# EAGLE design IMU_Digital_Combo_Board _-_6_Degrees_of_Freedom_-_ITG3200_-_ADXL345 (EAGLE 6.5.0)
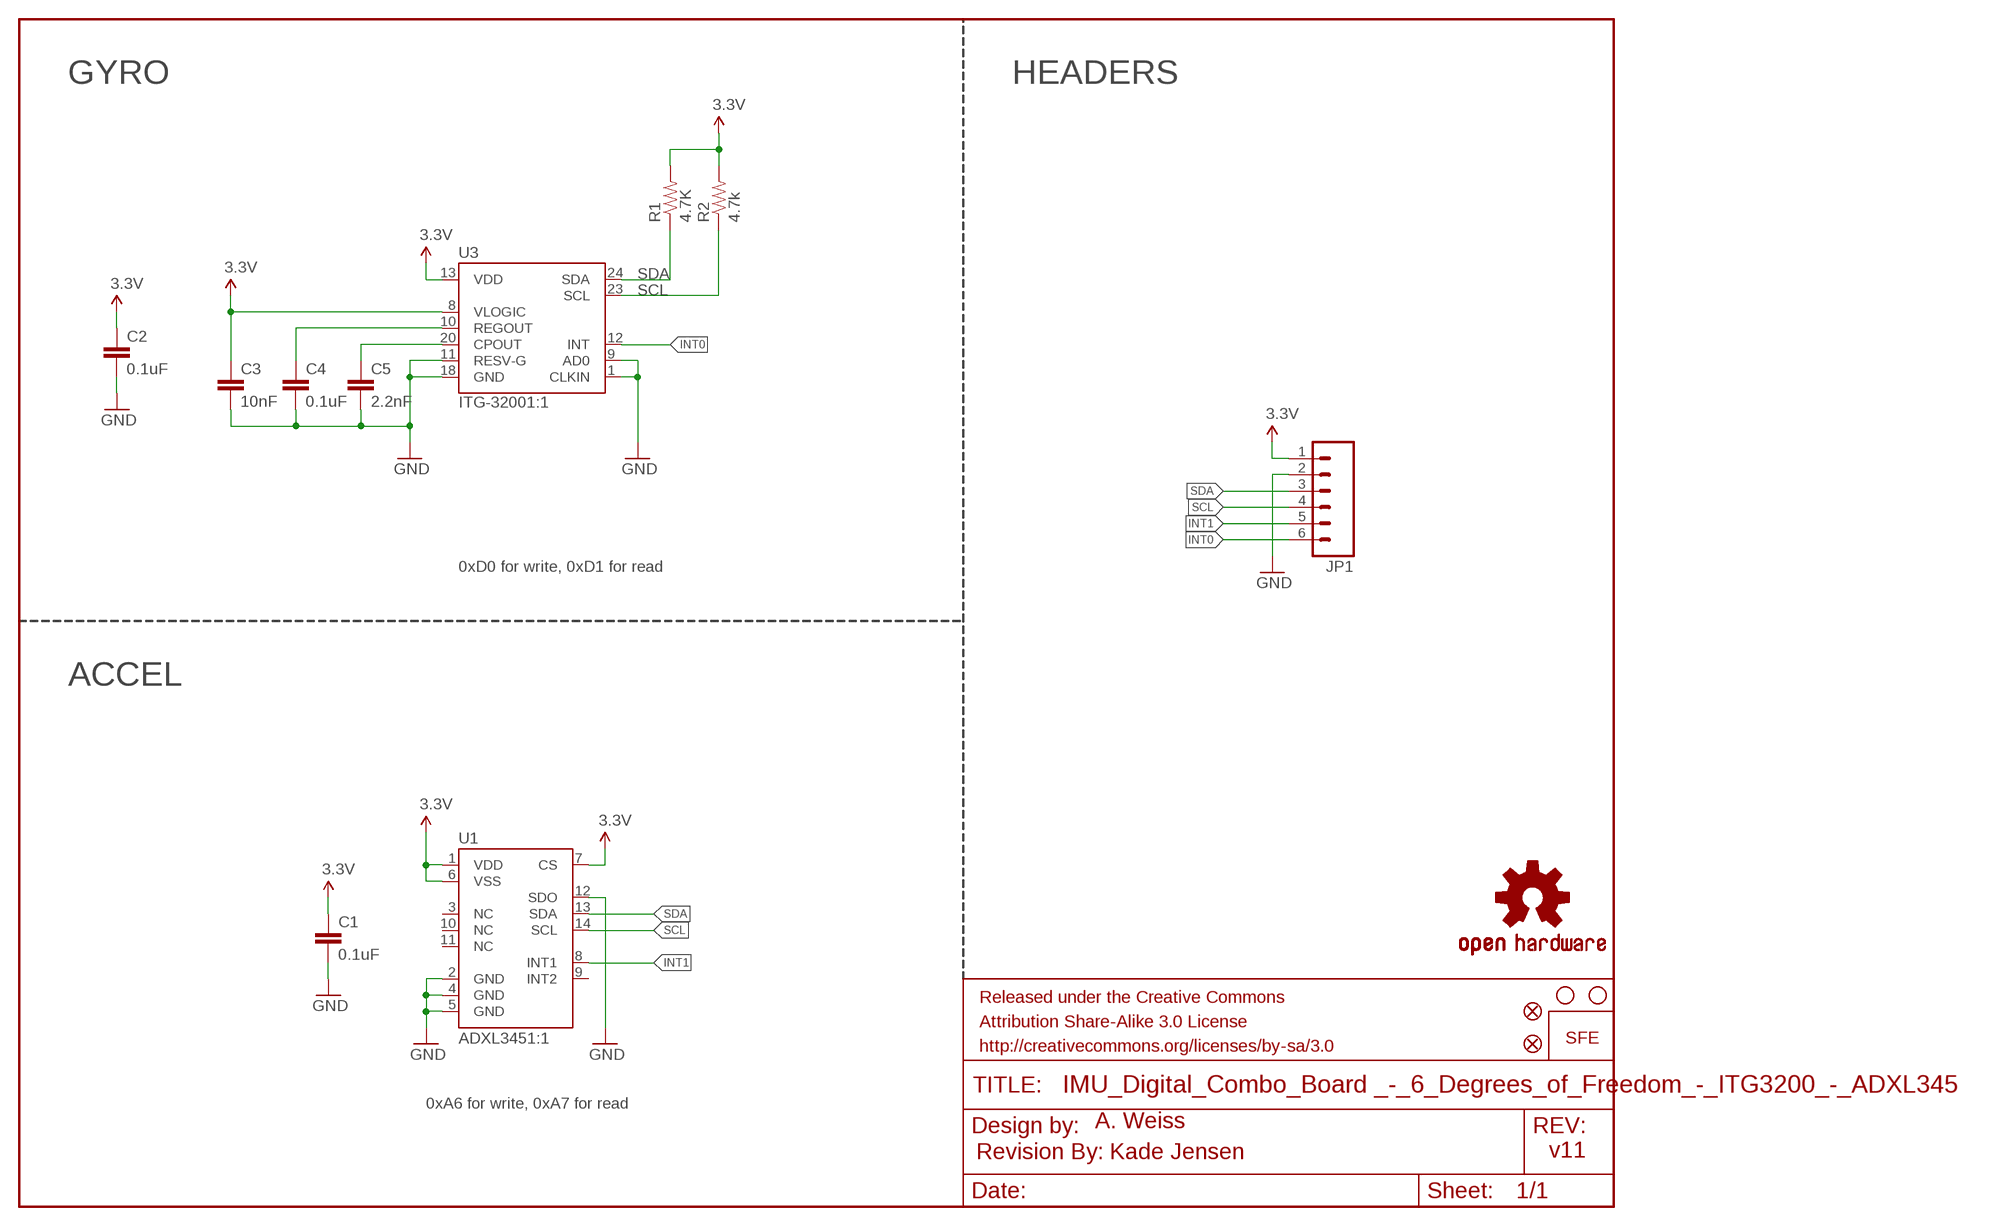
[diagram p0: schematic, sheet 1]

## Parts
C1  0.1uF  CAP0603-CAP  [0603-CAP]
C2  0.1uF  CAP0603-CAP  [0603-CAP]
C3  10nF  CAP0603-CAP  [0603-CAP]
C4  0.1uF  CAP0603-CAP  [0603-CAP]
C5  2.2nF  CAP0603-CAP  [0603-CAP]
FRAME1  FRAME-LETTER  [CREATIVE_COMMONS]
JP1  M06SIP  [1X06]
JP2  STAND-OFF  [STAND-OFF]
JP3  LOGO-SFESK  [SFE-LOGO-FLAME]
JP4  FIDUCIAL1X2  [FIDUCIAL-1X2]
JP5  STAND-OFF  [STAND-OFF]
JP6  FIDUCIAL1X2  [FIDUCIAL-1X2]
R1  4.7K  RESISTOR0603-RES  [0603-RES]
R2  4.7k  RESISTOR0603-RES  [0603-RES]
U1  ADXL3451:1  [LGA14]
U3  ITG-32001:1  [QFN-24_ITG3200_1:1]
U$1  REVISION  [REVISION]
U$2  OSHW-LOGOS  [OSHW-LOGO-S]

## Nets
3.3V: C1.1 C2.1 C3.1 JP1.1 R1.2 R2.2 U1.1(VDD) U1.6(VSS) U1.7(CS) U3.8(VLOGIC) U3.13(VDD)
GND: C1.2 C2.2 C3.2 C4.2 C5.2 JP1.2 U1.2(GND) U1.4(GND) U1.5(GND) U1.12(SDO) U3.1(CLKIN) U3.9(AD0) U3.11(RESV-G) U3.18(GND)
INT0: JP1.6 U3.12(INT)
INT1: JP1.5 U1.8(INT1)
N$2: C5.1 U3.20(CPOUT)
N$3: C4.1 U3.10(REGOUT)
SCL: JP1.4 R2.1 U1.14(SCL) U3.23(SCL)
SDA: JP1.3 R1.1 U1.13(SDA) U3.24(SDA)
Unconnected: U1.3(NC) U1.9(INT2) U1.10(NC) U1.11(NC)

## Notes on the sheet
- GYRO | HEADERS
- 0xD0 for write, 0xD1 for read
- ACCEL
- 0xA6 for write, 0xA7 for read
- A. Weiss
- Kade Jensen | v11

## Library data of the parts
C1-C5 = SparkFun:CAP: Capacitor Standard 0603 ceramic capacitor, and 0.1" leaded capacitor.
FRAME1 = SparkFun-Aesthetics:FRAME-LETTER: Schematic Frame Standard 8.5x11 US Letter frame
JP1 = SparkFun:M06: Header 6 Standard 6-pin 0.1" header. Use with straight break away headers (SKU : PRT-00116), right angle break away headers (PRT-00553), swiss pins (PRT-00743), machine pins (PRT-00117), and female headers (PRT-00115). Molex polarized connector foot print use with SKU : PRT-08094 with associated crimp pins and housings. NOTES ON THE VARIANTS LOCK and LOCK_LONGPADS... This footprint was designed to help hold the alignment of a through-hole component (i.e. 6-pin header) while soldering it into place. You may notice that each hole has been shifted either up or down by 0.005 of an inch from it's more standard position (which is a perfectly straight line). This slight alteration caused the pins (the squares in the middle) to touch the edges of the holes. Because they are alternating, it causes a "brace" to hold the component in place. 0.005 has proven to be the perfect amount of "off-center" position when using our standard breakaway headers. Although looks a little odd when you look at the bare footprint, once you have a header in there, the alteration is very hard to notice. Also, if you push a header all the way into place, it is covered up entirely on the bottom side. This idea of altering the position of holes to aid alignment will be further integrated into the Sparkfun Library for other footprints. It can help hold any component with 3 or more connection pins.
JP2 JP5 = SparkFun:STAND-OFF: Stand Off This is the mechanical footprint for a #4 phillips button head screw. Use the keepout ring to avoid running the screw head into surrounding components. SKU : PRT-00447
JP3 = SparkFun:LOGO-SFE: Spark Fun Electronics PCB Logo This is the standard Spark Fun Electronics PCB logo.
JP4 JP6 = SparkFun:FIDUCIAL: Fiducial Alignment Points Various fiducial points for machine vision alignment.
R1 R2 = SparkFun:RESISTOR: Resistor Basic schematic elements and footprints for 0603, 1206, and PTH resistors.
U1 = Testing:ADXL345
U3 = Testing:ITG-3200: ITG-3200 3-axis gyro, digital output, qfn24 package
U$1 = SparkFun-Aesthetics:REVISION
U$2 = SparkFun:OSHW-LOGO: Open Source Hardware Logo This logo indicates the piece of hardware it is found on incorporates a OSHW license and/or adheres to the definition of open source hardware found here: http://freedomdefined.org/OSHW

## Board
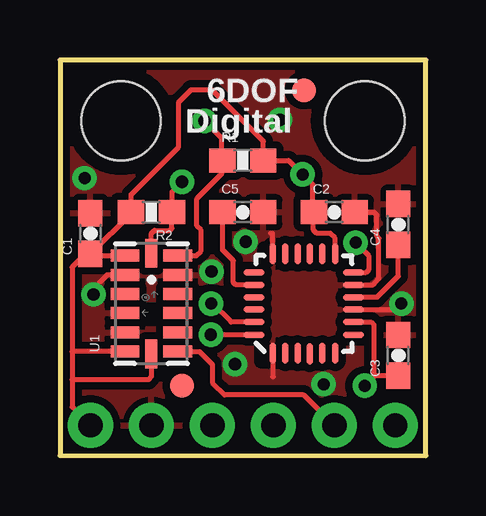
[diagram p1: board, top side]
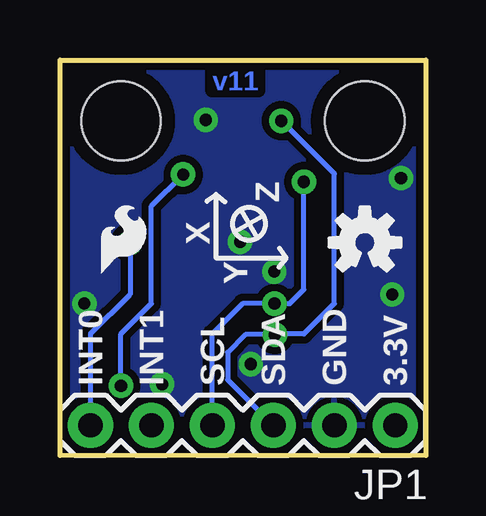
[diagram p2: board, bottom side, seen from below]

Size 15.24 x 16.51 mm. Coordinates in mm from the lower left corner, seen from the top.
Outline: 0,16.51 0,0.02 15.24,0 15.24,16.51 0,16.51
Copper layers (1*16): Top 0.035mm / dielectric 1.5mm / Bottom 0.035mm
Design rules "SparkFun": minimum track width 8mil, minimum drill 20mil, track to track 8mil, track to pad 8mil, pad to pad 8mil, via to via 8mil, smd to smd 8mil, copper to edge 8mil, drill to drill 8mil, minimum pad ring 12mil, minimum via ring 10mil, stop-mask expansion 4mil, vias tented up to drill 20mil, thermal gap 10mil
tRestrict: area 8.4,3.9 to 8.6,4.4; area 8.5,8.1 to 8.6,8.6; area 3.4,5.7 to 3.8,6.1; area 2.6,5.5 to 2.8,5.6

### Footprints (pad centres in the part's own frame; a part is rotated, then mirrored left to right if it is on the bottom)
0603-CAP = smd 1.1 x 1: 1 -0.85,0; 2 0.85,0
1X06 = drill 1.016 pad 1.88: 1 0,0; 2 2.54,0; 3 5.08,0; 4 7.62,0; 5 10.16,0; 6 12.7,0
STAND-OFF = hole 3.302: 0,0
FIDUCIAL-1X2 = smd 1 x 1: 1 0,0
0603-RES = smd 1.1 x 1: 1 -0.85,0; 2 0.85,0
LGA14 = smd 0.5 x 1.2: 1 2,1.1; 2 1.2,1.1; 3 0.4,1.1; 4 -0.4,1.1; 5 -1.2,1.1; 6 -2,1.1; 8 -2,-1.1; 9 -1.2,-1.1; 10 -0.4,-1.1; 11 0.4,-1.1; 12 1.2,-1.1; 13 2,-1.1 | smd 1.2 x 0.5: 7 -2.1,0; 14 2.1,0
QFN-24_ITG3200_1:1 = smd 0.889 x 0.279: 1 -2.076,1.301; 2 -2.076,0.775; 3 -2.076,0.25; 4 -2.102,-0.25; 5 -2.076,-0.775; 6 -2.076,-1.301; 13 2.076,-1.301; 14 2.076,-0.775; 15 2.076,-0.25; 16 2.076,0.25; 17 2.076,0.775; 18 2.076,1.301 | smd 0.279 x 0.889: 7 -1.301,-2.076; 8 -0.775,-2.076; 9 -0.25,-2.076; 10 0.25,-2.076; 11 0.775,-2.076; 12 1.301,-2.076; 19 1.301,2.076; 20 0.775,2.076; 21 0.25,2.076; 22 -0.25,2.076; 23 -0.775,2.076; 24 -1.301,2.076

### Placement (x,y rotation side)
C1  1.27,9.27 90 top
C2  11.43,10.16 0 top
C3  14.1,4.19 90 top
C4  14.1,9.65 90 top
C5  7.62,10.16 0 top
JP1  1.27,1.27 180 bottom
JP2  12.7,13.97 270 top
JP3  13.51,7.62 0 bottom
JP4  10.16,15.24 0 top
JP5  2.54,13.97 270 top
JP6  5.08,2.92 0 top
R1  7.62,12.32 0 top
R2  3.81,10.16 180 top
U1  3.81,6.35 90 top
U3  10.16,6.35 90 top
U$1  CREATIVE_COMMONS  [CREATIVE_COMMONS]  -6.35,-7.62 0 top  (outside the outline)
U$2  2.54,8.89 0 bottom

### Tracks (layer width: path | path; a pad name or v marks a point on that pad's centre or on a via)
3.3V  (via drill 0.51)
  Top 0.203: 2.81,4.25 U1.6 0.51,4.35 | 1.27,8.35 0.98,8.35 0.51,7.87 0.51,4.35 | 1.27,8.35 U1.1 | 0.51,4.35 0.51,3.17 | 0.51,3.17 0.51,2.03 JP1.1 | 1.27,8.35 C1.1 2.96,10.11 R2.2 2.96,10.9 4.94,12.88 4.94,14.74 5.46,15.27 6.33,15.27 8.47,13.12 R1.2 9.53,12.32 v10.11,11.73 10.54,11.3 10.54,10.2 arc90 C2.1 10.55,10.13 10.55,9.42 10.71,9.27 11.27,9.27 11.46,9.07 U3.13 | U3.8 12.97,5.58 13.08,5.46 13.08,3.3 v12.7,2.92 13.12,3.34 C3.1 | U1.7 3.81,3.3 3.68,3.17 0.51,3.17
  Bottom 0.203: v12.7,2.92 12.7,5.08 11.43,6.35 11.43,10.41 v10.11,11.73
GND  (via drill 0.51)
  Top 0.203: U3.1 8.86,3.3 8.89,3.3 | 8.89,8.39 U3.18 8.86,9.27 8.76,9.27 | U1.2 1.96,7.55 1.65,7.24 | C2.2 13.08,10.16 13.21,10.03 13.21,9.17 13.28,9.07 13.28,7.39 13.04,7.12 U3.11 | U3.9 13.97,6.1 v14.22,6.35
  other vias: 1.4,6.73 1.03,11.58 10.99,2.98 7.73,8.93 9.17,14.01 6.31,7.68 7.29,3.82
  pour Bottom (isolate 0.305): 15.24,16.51 0,16.51 0,0 15.24,0
  pour Top (isolate 0.305): 15.24,16.51 0,16.51 0,0 15.24,0
INT0  (via drill 0.51)
  Top 0.203: 12.27,7.62 U3.12 12.76,7.65 12.88,7.77 12.88,8.33 v12.32,8.89
  Bottom 0.203: JP1.6 13.97,5.08 12.32,6.73 v12.32,8.89
INT1
  Top 0.203: JP1.5 10.16,2.54 6.86,2.54 6.35,3.05 6.35,3.81 5.81,4.35 U1.8
N$2
  Top 0.203: C5.1 6.77,8.6 7.23,8.14 7.23,7.23 7.33,7.12 U3.20
N$3
  Top 0.203: C4.1 14.1,7.49 13.21,6.6 U3.10
SCL  (via drill 0.51)
  Top 0.203: v5.08,11.43 4.66,11.01 R2.1 4.66,9.49 4.57,9.4 3.94,9.4 3.81,9.27 U1.14 | U3.23 7.12,5.58 6.35,6.35 v6.3,6.35
  Bottom 0.203: JP1.4 8.89,5.08 7.62,6.35 v6.3,6.35 5.66,6.35 5.08,6.93 v5.08,11.43
SDA  (via drill 0.51)
  Top 0.203: R1.1 6.73,12.32 | U1.13 5.68,8.35 5.88,8.55 5.88,9.41 5.7,9.59 5.7,10.73 6.73,11.76 6.73,12.32 | 6.73,12.32 6.73,13.26 v6.02,13.97 | U3.24 v6.29,5.05
  Bottom 0.203: v6.02,13.97 3.81,11.76 3.81,6.35 5.08,5.08 6.26,5.08 v6.29,5.05 7.52,5.05 8.26,4.32 8.26,3.17 JP1.3

### Text on the board
Bottom: v11
tPlace: 6DOF | Digital
bPlace: Z | X | Y | 3.3V | GND | SDA | SCL | INT1 | INT0
tValues: A. Weiss | Revised by: Kade Jensen